# Altium schematic sheet MSXII_SteeringWheelLeftBoard.SchDoc: Steering Wheel Left Board
size Letter; Organization: Midnight Sun Solar Rayce Car Team; Address1: University of Waterloo; Address2: 200 University Ave W; Address3: Waterloo, ON, Canada; Address4: N2L 3E9; Revision: 1.11; SheetNumber: 2; SheetTotal: 2; Website: www.uwmidsun.com; ProjectName: Driver Controls
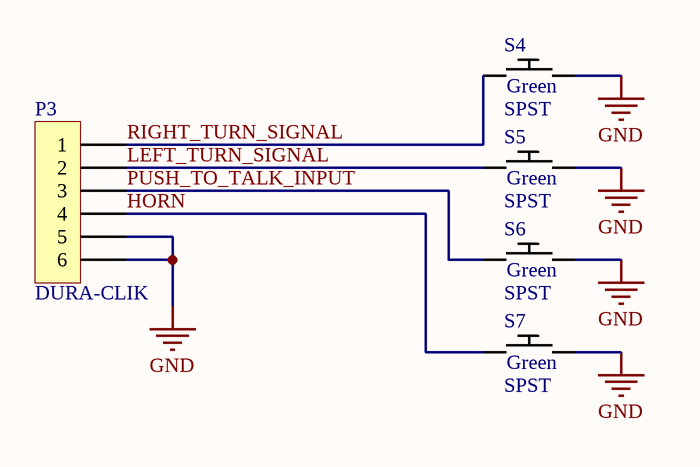
[diagram p0: MSXII_SteeringWheelLeftBoard.SchDoc]

## Parts
P3  DURA-CLIK  [CONN, 6POS DURA-CLIK VERT]
S4  SPST  [SW SPST D6 SERIES GREEN]
S5  SPST  [SW SPST D6 SERIES GREEN]
S6  SPST  [SW SPST D6 SERIES GREEN]
S7  SPST  [SW SPST D6 SERIES GREEN]

## Nets
GND: P3.5 P3.6 S4.2 S5.2 S6.2 S7.2
HORN: P3.4 S7.1
LEFT_TURN_SIGNAL: P3.2 S5.1
PUSH_TO_TALK_INPUT: P3.3 S6.1
RIGHT_TURN_SIGNAL: P3.1 S4.1

## Notes on the sheet
- Project:
- Title:
- Size:
- Project Lead:
- Letter
- Revision:
- University of Waterloo
- 200 University Ave W
- Waterloo, ON, Canada
- N2L 3E9
- Date:
- Sheet
- of
- Website:

## Library data of the parts
P3 = CONN 6POS DURA-CLIK 0.079": 6 Positions Header, Shrouded Connector 0.079" (2.00mm) Surface Mount, Vertical Tin; Manufacturer: Molex; Manufacturer Part Number: 5600200820; Style: Board to Cable/Wire; Shrouding: Shrouded - 4 Wall; Number of Positions: 6; Number of Positions Loaded: All; Mated Stacking Heights: 9.3mm; Supplier 1: Digi-Key; Supplier Part Number 1: WM10866CT-ND; RoHS: RoHS Compliant; Category: Connectors, Interconnects; Stock 1: 3826; Pricing 1: 1=1.76, 10=1.542, 25=1.4512, 50=1.391, 100=1.3305, 250=1.20956 (CAD); Packaging: Cut Tape (CT); Part Status: Active; Connector Type: Header; Contact Type: Male Pin; Pitch - Mating: 0.079" (2.00mm); Number of Rows: 1; Row Spacing - Mating: -; Mounting Type: Surface Mount; Termination: Solder; Fastening Type: Latch Lock; Contact Length - Mating: -; Contact Length - Post: -; Overall Contact Length: -; Insulation Height: 0.315" (8.00mm); Contact Shape: Square; Contact Finish - Mating: Tin; Contact Finish Thickness - Mating: -; Contact Finish - Post: Tin; Contact Material: Copper Alloy; Insulation Material: Polyamide (PA), Nylon; Features: Solder Retention; Operating Temperature: -; Ingress Protection: -; Material Flammability Rating: -; Insulation Color: Natural; Current Rating: -; Voltage Rating: -; Contact Finish Thickness - Post: -; Applications: Automotive, Industrial; ComponentLink1URL: http://www.molex.com/pdm_docs/sd/5600200220_sd.pdf; ComponentLink1Description: http://www.molex.com/pdm_docs/sd/5600200220_sd.pdf
S4-S7 = SW SPST-NO 0.1A 32V D6 Series Green: Pushbutton Switch SPST-NO Keyswitch Through Hole D6 Series Green; Manufacturer: C&K; Manufacturer Part Number: D6R50 F1 LFS; Switch Function: Off-Mom; Current Rating: 100mA (DC); Voltage Rating - DC: 32V; Actuator Type: Round, Button; Electrical Life: 250,000 Cycles; Supplier 1: Digi-Key; RoHS: RoHS Compliant; Category: Switches; Stock 1: 3742; Pricing 1: 1=1.73, 10=1.607, 25=1.5308, 50=1.454, 100=1.4158, 250=1.37756, 500=1.30102, 1000=1.22448, 5000=1.03316 (CAD); Packaging: Bulk; Part Status: Active; Type: Keyswitch; Circuit: SPST-NO; Voltage Rating - AC: -; Color - Actuator/Cap: Green; Illumination Type, Color: -; Illumination Voltage (Nominal): -; Mounting Type: Through Hole; Termination Style: PC Pin; Ingress Protection: -; Features: Tactile Feedback; Panel Cutout Dimensions: -; Operating Temperature: -20°C ~ 85°C; Mechanical Life: -; ComponentLink1URL: http://www.ckswitches.com/media/1341/d6.pdf; ComponentLink1Description: http://www.ckswitches.com/media/1341/d6.pdf; Supplier Part Number 1: 401-1976-ND